# EAGLE design Adafruit AMG8833 (EAGLE 9.6.1)
COMPANY: ADAFRUIT INDUSTRIES; DRAWN: KTOWN; REV: A; YEAR: 2017
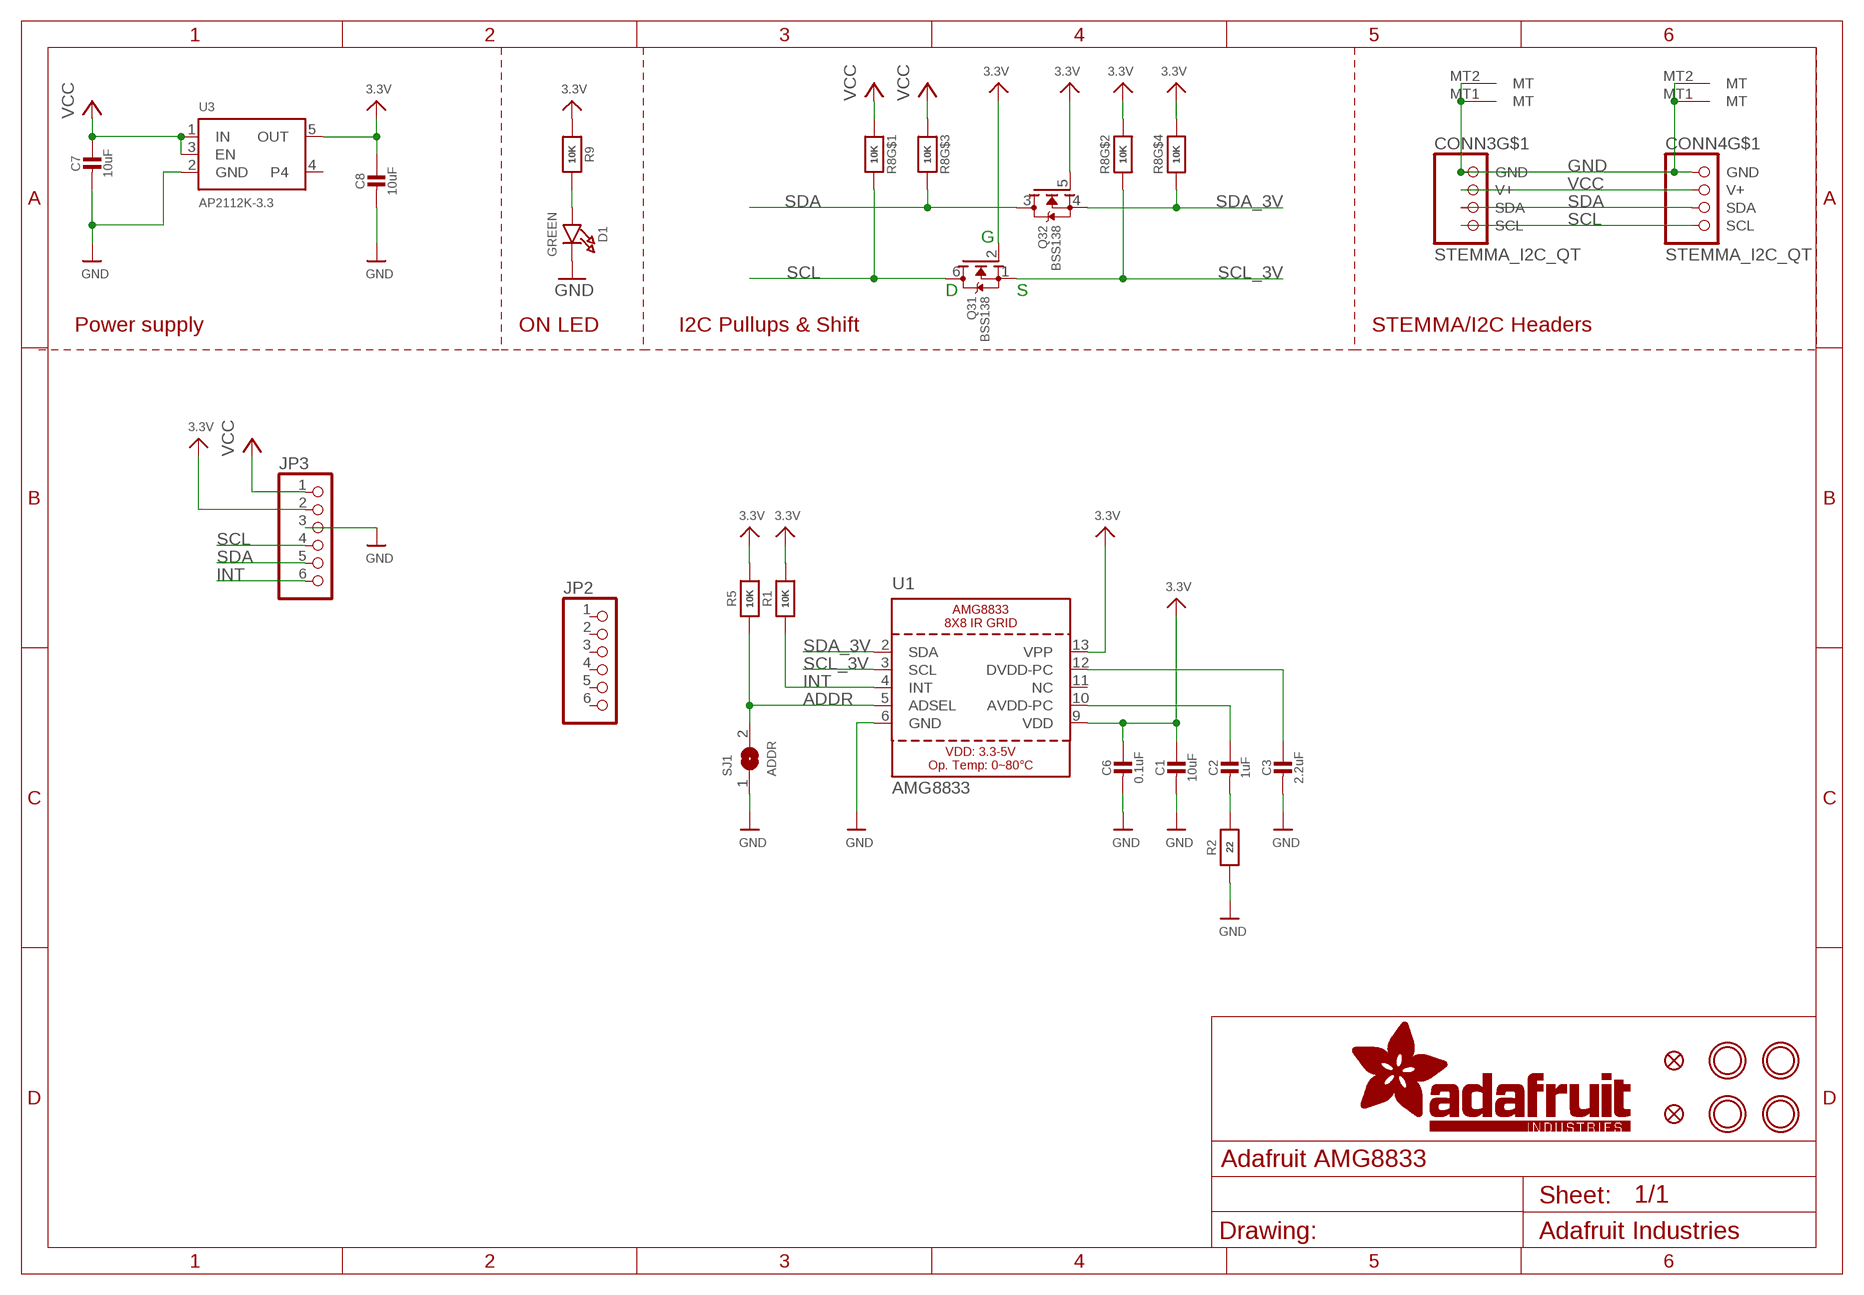
[diagram p0: schematic, sheet 1]

## Parts
C1  10uF  CAP_CERAMIC0805-NOOUTLINE  [0805-NO]
C2  1uF  CAP_CERAMIC0603_NO  [0603-NO]
C3  2.2uF  CAP_CERAMIC0805-NOOUTLINE  [0805-NO]
C6  0.1uF  CAP_CERAMIC0603_NO  [0603-NO]
C7  10uF  CAP_CERAMIC0805-NOOUTLINE  [0805-NO]
C8  10uF  CAP_CERAMIC0805-NOOUTLINE  [0805-NO]
CONN3  STEMMA_I2C_QT  [JST_SH4]
CONN4  STEMMA_I2C_QT  [JST_SH4]
D1  GREEN  LED0603_NOOUTLINE  [CHIPLED_0603_NOOUTLINE]
FID1  FIDUCIAL_1MM  [FIDUCIAL_1MM]
FID4  FIDUCIAL_1MM  [FIDUCIAL_1MM]
JP2  HEADER-1X670MIL  [1X06_ROUND_70]
JP3  HEADER-1X670MIL  [1X06_ROUND_70]
Q3  BSS138  MOSFET-N_DUAL  [SOT363]
R1  10K  RESISTOR_0603_NOOUT  [0603-NO]
R2  22  RESISTOR_0603_NOOUT  [0603-NO]
R5  10K  RESISTOR_0603_NOOUT  [0603-NO]
R8  10K  RESISTOR_4PACK  [RESPACK_4X0603]
R9  10K  RESISTOR_0603_NOOUT  [0603-NO]
SJ1  ADDR  SOLDERJUMPER  [SOLDERJUMPER_ARROW_NOPASTE]
U1  AMG8833  [AMG8833]
U3  AP2112K-3.3  VREG_SOT23-5  [SOT23-5]
U$40  MOUNTINGHOLE2.5  [MOUNTINGHOLE_2.5_PLATED]
U$41  MOUNTINGHOLE2.5  [MOUNTINGHOLE_2.5_PLATED]
U$43  MOUNTINGHOLE2.5  [MOUNTINGHOLE_2.5_PLATED]
U$44  MOUNTINGHOLE2.5  [MOUNTINGHOLE_2.5_PLATED]

## Nets
3.3V: C1.1 C6.1 C8.1 JP3.2 Q3.2(1:G) Q3.5(2:G) R1.2 R5.2 R8.2 R8.4 R9.1 U1.9(VDD) U1.13(VPP) U3.5(OUT)
ADDR: R5.1 SJ1.2 U1.5(ADSEL)
AVDD-PC: C2.1 U1.10(AVDD-PC)
DVDD-PC: C3.1 U1.12(DVDD-PC)
GND: C1.2 C3.2 C6.2 C7.2 C8.2 CONN3.1(GND) CONN3.MT1(MT) CONN3.MT2(MT) CONN4.1(GND) CONN4.MT1(MT) CONN4.MT2(MT) D1.C JP3.3 R2.1 SJ1.1 U1.6(GND) U3.2(GND)
INT: JP3.6 R1.1 U1.4(INT)
N$1: D1.A R9.2
N$4: C2.2 R2.2
SCL: CONN3.4(SCL) CONN4.4(SCL) JP3.4 Q3.6(1:D) R8.8
SCL_3V: Q3.1(1:S) R8.7 U1.3(SCL)
SDA: CONN3.3(SDA) CONN4.3(SDA) JP3.5 Q3.3(2:D) R8.6
SDA_3V: Q3.4(2:S) R8.5 U1.2(SDA)
VCC [highpower]: C7.1 CONN3.2(V+) CONN4.2(V+) JP3.1 R8.1 R8.3 U3.1(IN) U3.3(EN)
Unconnected: JP2.1 JP2.2 JP2.3 JP2.4 JP2.5 JP2.6 U1.11(NC) U3.4

## Notes on the sheet
- G
- D | S
- Power supply | ON LED | I2C Pullups & Shift | STEMMA/I2C Headers

## Library data of the parts
C1-C3 C6-C8 = microbuilder:CAP_CERAMIC: Ceramic Capacitors For new designs, use the packages preceded by an '_' character since they are more reliable: The following footprints should be used on most boards: _0402 - Standard footprint for regular board layouts _0603 - Standard footprint for regular board layouts _0805 - Standard footprint for regular board layouts _1206 - Standard footprint for regular board layouts For extremely tight-pitch boards where space is at a premium, the following 'micro-pitch' footprints can be used (smaller pads, no silkscreen outline, etc.): _0402MP - Micro-pitch footprint for very dense/compact boards _0603MP - Micro-pitch footprint for very dense/compact boards _0805MP - Micro-pitch footprint for very dense/compact boards _1206MP - Micro-pitch footprint for very dense/compact boards
CONN3 CONN4 = microbuilder:STEMMA_I2C
D1 = microbuilder:LED: LED 0603 - 0603 Surface Mount Package 2mA: Green LED - Low Power (3.9mcd, 2ma, 1.7Vf) - Digikey: 475-2709-2-ND Orange LED - Low Power (9.8mcd, 2ma, 1.8Vf) - Digikey: 475-1194-2-ND Red LED - Low Power (5mcd, 2ma, 1.8Vf) - Digikey: 475-1195-2-ND Yellow LED - Low Power (7mcd, 2ma, 1.8Vf) - Digikey: 475-1196-2-ND 5mA: Blue LED - Low Power (17mcd, 5ma, 2.9Vf) - Digikey: LNJ937W8CRACT-ND 0805 - 0805 Surface Mount Package 2mA: Red LED (8.8mcd, 2mA, 1.8Vf, Clear) - Low Power [Digikey: 475-2510-1-ND] Green LED (5mcd, 2mA, 1.8Vf, Clear) - Low Power [Digikey: 475-2730-1-ND] Yellow LED (11.3mcd, 2mA, 1.8Vf, Clear) - Low Power [Digikey: 475-2555-1-ND] 20mA: Red LED (104mcd, 20mA, Diffused) - LS R976 [Digikey: 475-1278-6-ND] Red LED (12mcd, 20mA, 2.0Vf, Clear) - APT2012EC [Digikey: 754-1128-1-ND] Green LED (15mcd, 20mA, 2.2Vf, Clear) - APT2012GC [Digikey: 754-1131-1-ND] Orange LED (160mcd, 20mA, 2.1Vf, Clear) - APT2012SECK [Digikey: 754-1130-1-ND] 1206 - 1206 Surface Mount Package Green LED (26mcd, 20mA, Diffused) - LG N971 [Digikey: 475-1407-6-ND] Red LED (15mcd, 20mA, Diffused) - LH N974 [Digikey: 475-1416-6-ND] Cree - Cree High-Power Surface Mount LEDs XPEBWT-L1-0000-00D50 - White 111lm 350mA 2.9Vf 6200K 110° XTEAWT-00-0000-00000LEE3 - White 114lm 350mA 2.85Vf 5000K 115° Everlight - Everlight 45-21 Series Surface Mount LEDs 45-21/QK2C-B2832AC2CB2/2T - Warm White 2000mcd 20mA 3.25Vf 3050K 120° 45-21/LK2C-B38452C4CB2/2T - Nuetral White 2000mcd 20mA 3.25Vf 4150K 120° 45-21/LK2C-B50634C6CB2/2T - Cold White 2200mcd 20mA 3.25Vf 5650K 120° PLCC2 Reverse Mount LS T77K-J1L2-1-0-2-R18-Z - Red 11.25mcd 2mA 1.8Vf 630nm 120° LO T77K-L1M2-24-Z - Orange 19.6mcd 2mA 1.8Vf 606nm 120° LY T77K-K2M1-26-Z - Yellow 15.7mcd 2mA 1.8Vf 587nm 120°
FID1 FID4 = microbuilder:FIDUCIAL: Fiducial Alignment Points Various fiducial points for machine vision alignment.; BOM: EXCLUDE
JP2 JP3 = microbuilder:HEADER-1X6: PIN HEADER
Q3 = microbuilder:MOSFET-N_DUAL: Dual N-Channel MOSFET SOT363 (2.0x1.25mm) 2N7002PS - 60V, 320mA [Digikey: 568-5984-1-ND]
R1 R2 R5 R9 = microbuilder:RESISTOR: Resistors For new designs, use the packages preceded by an '_' character since they are more reliable: The following footprints should be used on most boards: _0402 - Standard footprint for regular board layouts _0603 - Standard footprint for regular board layouts _0805 - Standard footprint for regular board layouts _1206 - Standard footprint for regular board layouts For extremely tight-pitch boards where space is at a premium, the following 'micro-pitch' footprints can be used (smaller pads, no silkscreen outline, etc.): _0402MP - Micro-pitch footprint for very dense/compact boards _0603MP - Micro-pitch footprint for very dense/compact boards _0805MP - Micro-pitch footprint for very dense/compact boards _1206MP - Micro-pitch footprint for very dense/compact boards
R8 = microbuilder:RESISTOR_4PACK: Resistor Packs (4 resistors) 4 x 0603 10K 1/16W - Digikey: YC164J-10KCT-ND
SJ1 = microbuilder:SOLDERJUMPER: SMD Solder JUMPER Solder the two pads together to create a connection, or remove the solder to break it. REFLOW - Use this footprint for solder paste and reflow ovens. WAVE - Use this footprint for hand-soldering (larger pads). CLOSED - Has a trace between the two pads to ensure it is closed by default. The trace needs to be cut to disable the jumper, and can be closed again by creating a solder bridge between the two pads.; BOM: EXCLUDE
U1 = microbuilder:AMG8833: AMG8833 8x8 IR Grid Sensor Viewing Angle: ~60° Temp Accuracy: +/-2-3°C (high/low gain)
U3 = microbuilder:VREG_SOT23-5: SOT23-5 Fixed Voltage Regulators Part Current Out V Out V In V Dropout θJA (°C/W) TJ (°C) Digikey Part No. ADP121 150mA 3.3V 3.4-5.5V 0.09V @ 150mA -- -- ADP121-AUJZ33R7CT-ND ADP121 150mA 3.0V 3.1-5.5V 0.09V @ 150mA -- -- ADP121-AUJZ30R7CT-ND ADP122 300mA 3.3V 3.4-5.5V 0.085V @ 300mA -- -- ADP122AUJZ-3.3-R7CT-ND ADP1712 300mA 3.3V 3.5-5.5V 0.17V @ 300mA -- -- ADP1712AUJZ-3.3-R7TR-ND AP7311 (Low Cost) 150mA 3.3V 3.5-6V 0.15V @ 150mA -- -- AP7311-33WG-7DICT-ND LD39015M18R 150mA 1.8V 1.9V-5.5V 0.08V @ 100mA -- -- 497-6977-1-ND LP2985A-33DBVR 150mA 3.3V 3.3-16V 0.28V @ 150mA 206 150 296-18479-1-ND MCP1824T-3302E/OT 300mA 3.3V 3.5V-6V 0.2V @ 300mA -- -- MCP1824T-3302E/OTCT-ND MIC5205-2.5YM5 TR 150mA 2.5V 2.7-16V 0.165V @ 150mA -- -- 576-1257-2-ND MIC5205-3.0YM5 TR 150mA 3.0V 3.2V-16V 0.165V @ 150mA -- -- 576-1258-2-ND MIC5205-3.3YM5 TR 150mA 3.3V 3.5V-16V 0.165V @ 150mA -- -- 576-1259-2-ND TPS780330220 150mA 3.3V+2.2V 3.6-5.5V 250mV Max -- -- 296-23332-1-ND TDA3663/N1,135 100mA 3.3V 3.5-45V 0.18V @ 50mA -- -- 568-5343-1-ND Max operating temp can be calculated using θJA, TJ (max junction temperature), and power in watts. Set the "Maximum Ambient Temperature" until it reaches TJ ("Max Junction Temperature"), which is the absolute limit for safe use of the regulator: Heat Sink Temperature Calculator <http://www.daycounter.com/Calculators/Heat-Sink-Temperature-Calculator.phtml> For example, With 12V source into a 3.3V LP2985 and a 30mA load, we are dissipating (12V-3.3V) * 0.03A = 0.261W. With a θJA of 206 °C/W, a TJ of 150°C, and 261mW we can safely use the chip without a heat sink up to 75°C (=147.1°C Junction Temperature).
U$40 U$41 U$43 U$44 = microbuilder:MOUNTINGHOLE: Mounting Hole For #2 screws (0.086"/2.18mm width, 0.094"/2.4mm hole) use 2.5mm; BOM: EXCLUDE

## Net classes
1 highpower: width 0.305 mm, drill 0.483 mm
2 lowpower: width 0.254 mm, drill 0.483 mm

## Board
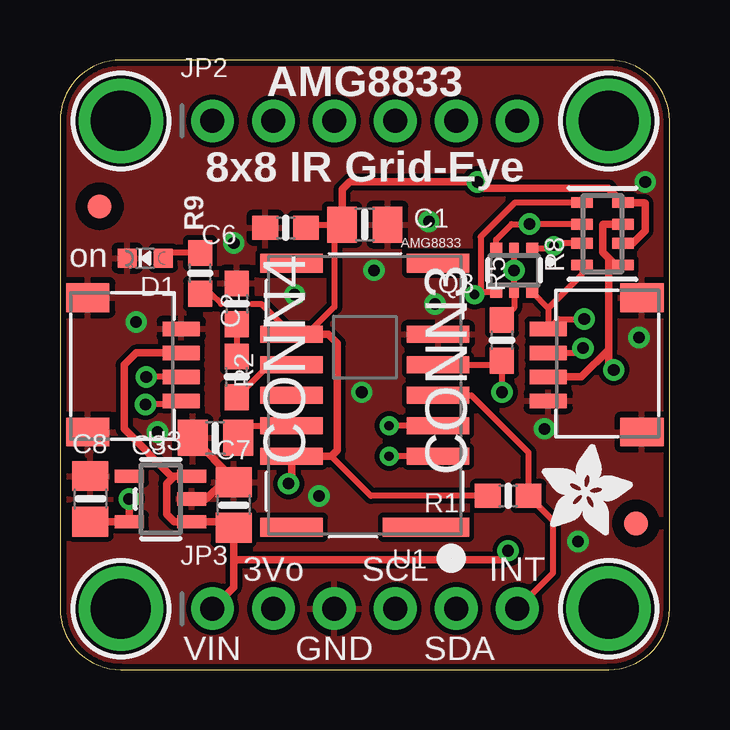
[diagram p1: board, top side]
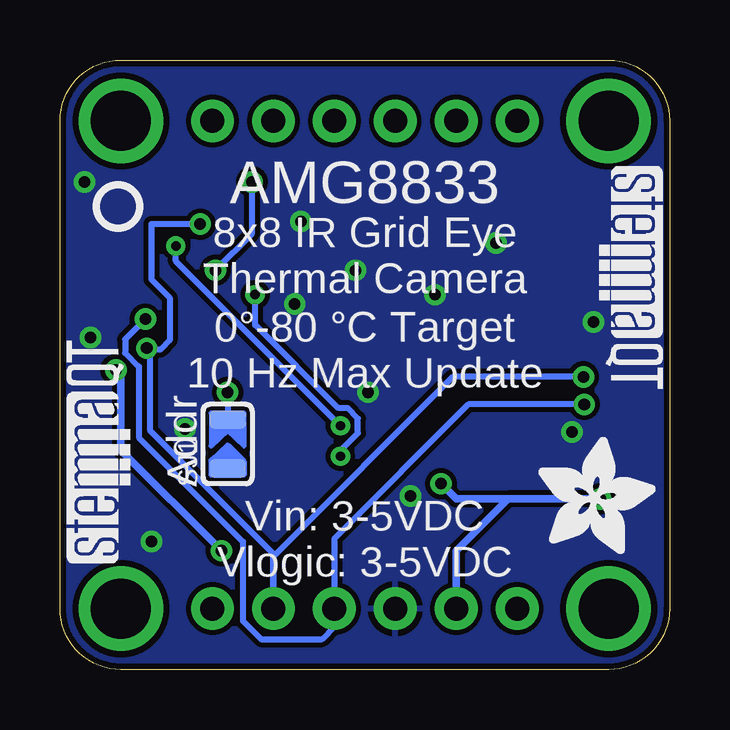
[diagram p2: board, bottom side, seen from below]

Size 25.4 x 25.4 mm. Coordinates in mm from the lower left corner, seen from the top.
Outline: 0,22.86 0,2.54 arc90 2.54,0 22.86,0 arc90 25.4,2.54 25.4,22.86 arc90 22.86,25.4 2.54,25.4 arc90 0,22.86
Copper layers (1*16): Top 0.035mm / dielectric 1.5mm / Bottom 0.035mm
Design rules "adafruit": minimum track width 8mil, minimum drill 15.5mil, track to track 8mil, track to pad 8mil, pad to pad 8mil, via to via 8mil, smd to smd 8mil, copper to edge 10mil, drill to drill 8mil, minimum pad ring 10mil, minimum via ring 8mil, stop-mask expansion 2mil, vias tented up to drill 20mil, thermal gap 10mil

### Footprints (pad centres in the part's own frame; a part is rotated, then mirrored left to right if it is on the bottom)
0805-NO = smd 1.24 x 1.5: 1 -0.95,0; 2 0.95,0
0603-NO = smd 1.075 x 1: 1 -0.85,0; 2 0.85,0
JST_SH4 = smd 0.6 x 1.55: 1 -1.5,2.514; 2 -0.5,2.514; 3 0.5,2.514; 4 1.5,2.514 | smd 1.2 x 1.8: MT1 -2.8,-1.386; MT2 2.8,-1.386
CHIPLED_0603_NOOUTLINE = smd 0.8 x 0.8: A 0,-0.75; C 0,0.75
FIDUCIAL_1MM = smd 1 x 1: 1 0,0
1X06_ROUND_70 = drill 1 pad 1.778: 1 -6.35,0; 2 -3.81,0; 3 -1.27,0; 4 1.27,0; 5 3.81,0; 6 6.35,0
SOT363 = smd 0.5 x 0.5: 1 -0.75,-0.9; 3 0.75,-0.9; 4 0.75,0.9; 6 -0.75,0.9 | smd 0.4 x 0.5: 2 0,-0.9; 5 0,0.9
RESPACK_4X0603 = smd 0.45 x 0.9: 1 -1.3,-0.85; 2 -0.4,-0.85; 3 0.4,-0.85; 4 1.3,-0.85; 5 1.3,0.85; 6 0.4,0.85; 7 -0.4,0.85; 8 -1.3,0.85
SOLDERJUMPER_ARROW_NOPASTE = smd 0.762 x 1.524: 1 -1.016,0; 2 1.016,0
AMG8833 = smd 0.8 x 3.6: 1 -5.5,-2.55 | smd 0.7 x 2.6: 2 -2.54,-3.05; 3 -1.27,-3.05; 4 0,-3.05; 5 1.27,-3.05; 6 2.54,-3.05; 9 2.54,3.05; 10 1.27,3.05; 11 0,3.05; 12 -1.27,3.05; 13 -2.54,3.05 | smd 0.8 x 2.6: 7 5.5,-3.05; 8 5.5,3.05; 14 -5.5,3.05
SOT23-5 = smd 0.55 x 1.2: 1 -0.95,-1.3; 2 0,-1.3; 3 0.95,-1.3; 4 0.95,1.3; 5 -0.95,1.3
MOUNTINGHOLE_2.5_PLATED = drill 2.5 pad 3.2: P$1 0,0

### Placement (x,y rotation side)
C1  12.7,18.54 0 top
C2  7.37,12.19 90 top
C3  6.48,9.65 180 top
C6  9.4,18.41 180 top
C7  7.24,6.86 90 top
C8  1.27,7.11 90 top
CONN3  22.86,12.7 90 top
CONN4  2.54,12.7 270 top
D1  3.56,17.14 90 top
FID1  24,6.1 0 top
FID4  1.65,19.3 0 top
JP2  12.7,22.86 0 top
JP3  12.7,2.54 0 top
Q3  18.92,16.64 180 top
R1  18.67,7.24 180 top
R2  7.37,15.24 270 top
R5  18.41,13.72 90 top
R8  22.61,18.16 90 top
R9  5.84,16.51 90 top
SJ1  18.41,9.4 90 bottom
U1  12.7,11.43 90 top
U3  4.19,7.11 90 top
U$28  [ADAFRUIT_5MM]  5.46,4.83 0 bottom
U$40  2.54,22.86 0 top
U$41  22.86,22.86 0 top
U$43  2.54,2.54 0 top
U$44  22.86,2.54 0 top
U$46  [ADAFRUIT_3.5MM]  20.07,5.59 0 top
U$47  [PCBFEAT-REV-040]  22.99,19.3 0 bottom
U$48  [STEMMAQT]  22.48,4.45 90 bottom
U$49  [STEMMAQT]  2.92,20.95 270 bottom

### Tracks (layer width: path | path; a pad name or v marks a point on that pad's centre or on a via)
3.3V  (via drill 0.48)
  Top 0.203: 6.71,15.24 8,15.24
  Top 0.254: Q3.2 v18.92,16.64 Q3.5 18.92,15.07 R5.2 | R9.1 6.29,15.66 6.71,15.24 | 8,15.24 8.38,15.24 U1.9 10.29,13.97 11.43,15.11 11.43,18.22 C1.1 10.38,18.54 C6.1 | R1.2 12.95,7.24 11.3,8.89
  Top 0.305: C8.1 U3.5 v2.88,7.11 | v9.53,7.75 9.65,7.87 U1.13 11.3,8.89 11.56,9.14 11.56,13.59 11.18,13.97 U1.9 | R8.2 23.86,17.76 24.38,18.29 24.38,19.43 24.35,19.46 R8.4 22.85,20.07 17.65,20.07 v17.4,20.32 12.06,20.32 11.75,20 C1.1
  Bottom 0.254: v18.92,16.64 17.4,18.16 v17.4,20.32
  Bottom 0.305: v2.88,7.11 6.73,7.11 | JP3.2 8.89,4.95 6.73,7.11 | v9.53,7.75 8.89,7.11 6.73,7.11
ADDR  (via drill 0.48)
  Top 0.254: U1.5 18.25,12.7 R5.1 v18.41,11.56
  Bottom 0.254: v18.41,11.56 SJ1.2
AVDD-PC
  Top 0.254: C2.1 8.72,12.7 U1.10
DVDD-PC
  Top 0.254: C3.1 7.93,10.16 U1.12
GND  (via drill 0.48)
  Top 0.305: U3.2 6.1,7.11 6.79,7.81 C7.2 7.24,7.94 C3.2
  other vias: 15.62,15.24 13.08,16.64 15.37,18.67 7.24,17.78 9.78,15.62 12.57,11.56 20.19,10.03 4.06,9.91 10.79,7.24 21.59,5.33 24.13,13.84 24.38,20.32 3.17,14.48
  pour Top: 0,25.4 25.4,25.4 25.4,0 0,0
  pour Bottom: 0,25.4 25.4,25.4 25.4,0 0,0
INT
  Top 0.254: U1.4 17.14,11.43 19.52,9.06 R1.1 20.54,6.22 20.54,4.03 JP3.6
N$1
  Top 0.254: R9.2 4.52,17.36 D1.A
N$4
  Top 0.254: R2.2 C2.2
SCL  (via drill 0.48)
  Top 0.254: Q3.6 20.35,15.06 | 20.35,15.06 CONN3.4 20.75,14.61 v21.84,14.61 | CONN4.4 4.9,11.05 v3.56,11.05 | R8.8 21.76,16.47 20.35,15.06
  Bottom 0.254: v3.56,11.05 8.38,11.05 13.97,5.46 JP3.4 13.97,1.78 14.48,1.27 17.02,1.27 17.78,2.03 17.78,5.33 22.12,9.67 22.12,12.63 22.69,13.2 22.69,13.76 v21.84,14.61
SCL_3V  (via drill 0.39)
  Top 0.254: U1.3 v13.72,10.16 | Q3.1 20.57,17.54 v20.57,17.65 20.57,17.76 R8.7
  Bottom 0.254: v13.72,10.16 20.57,17.02 v20.57,17.65
SDA  (via drill 0.48)
  Top 0.254: CONN4.3 3.6,12.2 v3.59,12.19 | Q3.3 18.17,17.92 18.82,18.56 v19.56,18.56 R8.6 | CONN3.3 21.59,13.2 v21.79,13.39
  Bottom 0.254: v3.59,12.19 9.03,12.19 16.51,4.71 JP3.5 16.51,4.83 21.66,9.97 21.66,13.27 v21.79,13.39 21.79,13.34 21.21,13.34 20.83,13.72 20.83,15.49 21.59,16.26 21.59,18.56 v19.56,18.56
SDA_3V  (via drill 0.39)
  Top 0.254: U1.2 v13.72,8.89 | v17.27,15.62 17.39,15.74 17.53,15.74 | 17.53,15.74 Q3.4 | R8.5 18.95,19.46 17.53,18.03 17.53,15.74
  Bottom 0.254: v13.72,8.89 13.72,9.13 12.99,9.86 12.99,10.46 13.41,10.89 13.8,10.89 17.27,14.36 v17.27,15.62
VCC  (via drill 0.48)
  Top 0.305: U3.3 4.76,8.06 4.7,8 | 4.7,8 4.45,7.75 4.45,6.48 4.76,6.16 U3.1 6.99,6.16 C7.1 7.24,4.45 | 7.24,4.45 7.24,3.43 JP3.1 | R8.3 22.62,18.56 22.61,18.54 22.61,17.4 22.86,17.14 | 22.86,17.14 23.14,16.86 R8.1 | CONN4.2 3.17,13.2 2.67,12.7 2.67,10.03 4.7,8 | 22.86,17.14 22.86,13.34 | 22.86,13.34 21.72,12.19 CONN3.2 | 7.24,4.45 7.37,4.57 18.41,4.57 18.67,4.83 v18.67,4.95 | v23.07,12.49 22.86,12.7 22.86,13.34
  Bottom 0.305: v18.67,4.95 22.86,9.14 22.86,12.28 v23.07,12.49

### Text on the board
tPlace: AMG8833 | 8x8 IR Grid-Eye | on | 3Vo | SCL | INT | VIN | GND | SDA
bPlace: AMG8833 | 8x8 IR Grid Eye / Thermal Camera | 0°-80 °C Target / 10 Hz Max Update | Addr | Vin: 3-5VDC / Vlogic: 3-5VDC
tValues: AMG8833